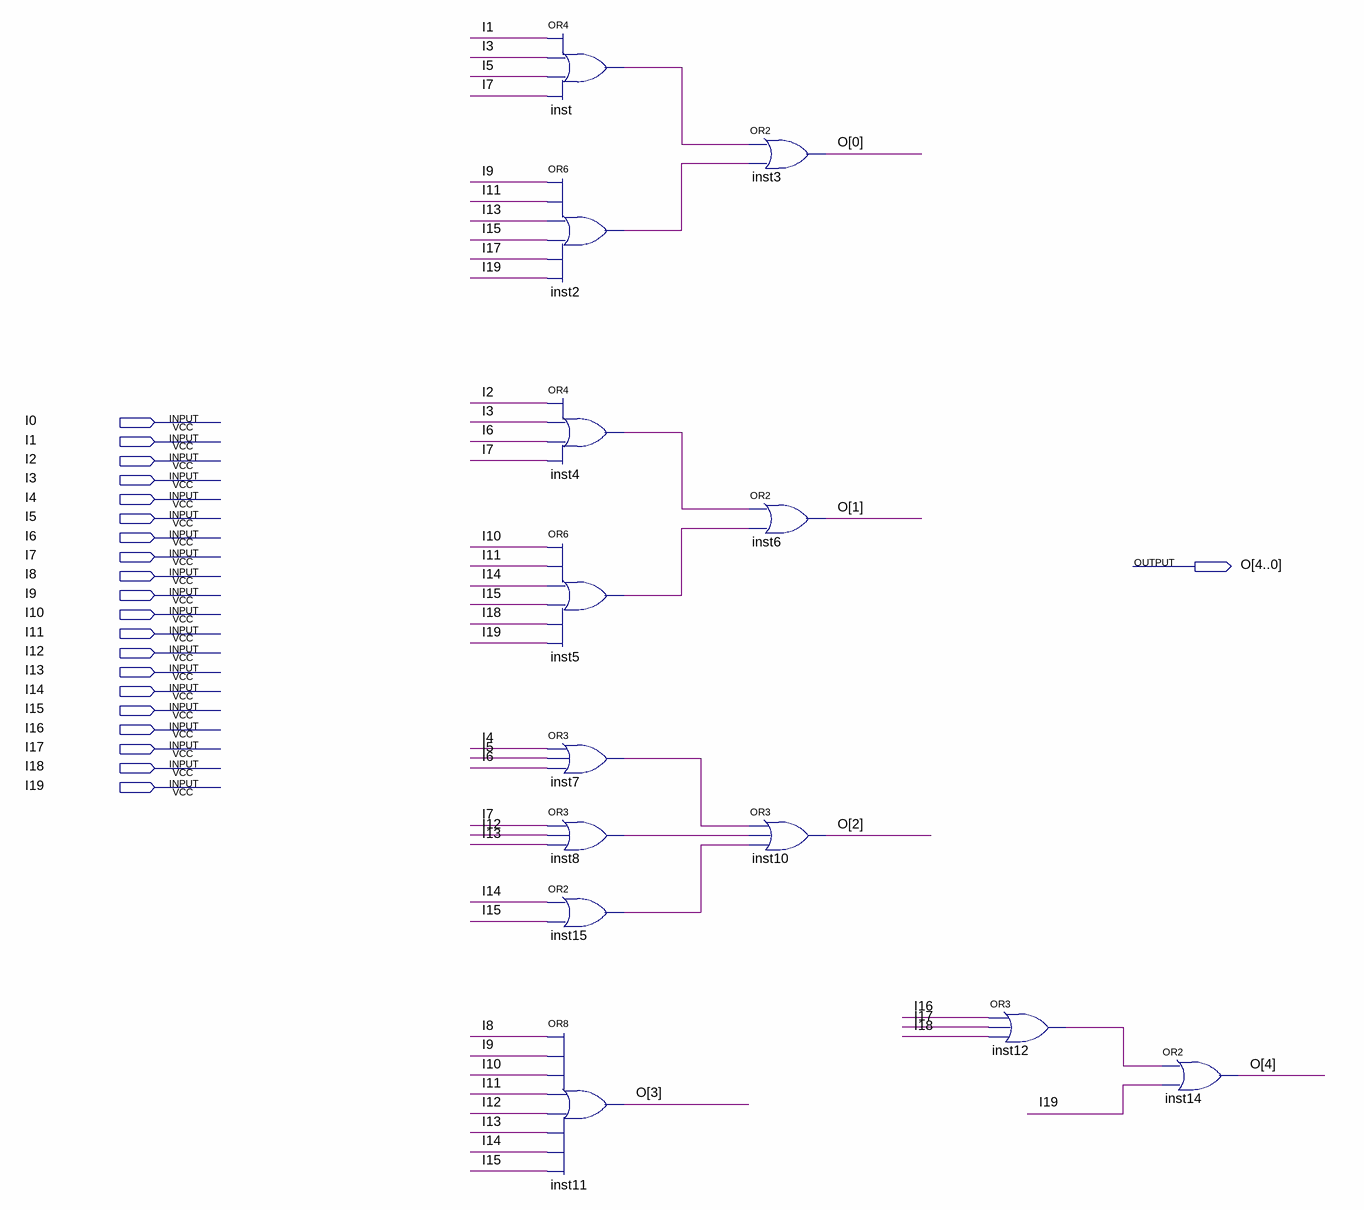
[diagram p0: schematic sheet]
// Quartus schematic encoder20.bdf as structural Verilog: 13 symbols, 21 pins
module encoder20 (
  input  I0,
  input  I1,
  input  I2,
  input  I3,
  input  I4,
  input  I5,
  input  I6,
  input  I7,
  input  I8,
  input  I9,
  input  I10,
  input  I11,
  input  I12,
  input  I13,
  input  I14,
  input  I15,
  input  I16,
  input  I17,
  input  I18,
  input  I19,
  output [4:0] O
);

  wire inst2_out, inst4_out, inst5_out, inst7_out, inst8_out, inst12_out, inst15_out, inst_out;

  or inst (inst_out, I1, I3, I5, I7);
  or inst2 (inst2_out, I9, I11, I13, I15, I17, I19);
  or inst4 (inst4_out, I2, I3, I6, I7);
  or inst5 (inst5_out, I10, I11, I14, I15, I18, I19);
  or inst7 (inst7_out, I4, I5, I6);
  or inst8 (inst8_out, I7, I12, I13);
  or inst15 (inst15_out, I14, I15);
  or inst11 (O[3], I8, I9, I10, I11, I12, I13, I14, I15);
  or inst3 (O[0], inst_out, inst2_out);
  or inst6 (O[1], inst4_out, inst5_out);
  or inst10 (O[2], inst7_out, inst8_out, inst15_out);
  or inst12 (inst12_out, I16, I17, I18);
  or inst14 (O[4], inst12_out, I19);
endmodule
